# Altium schematic sheet PCB Schematic.SchDoc
size Letter
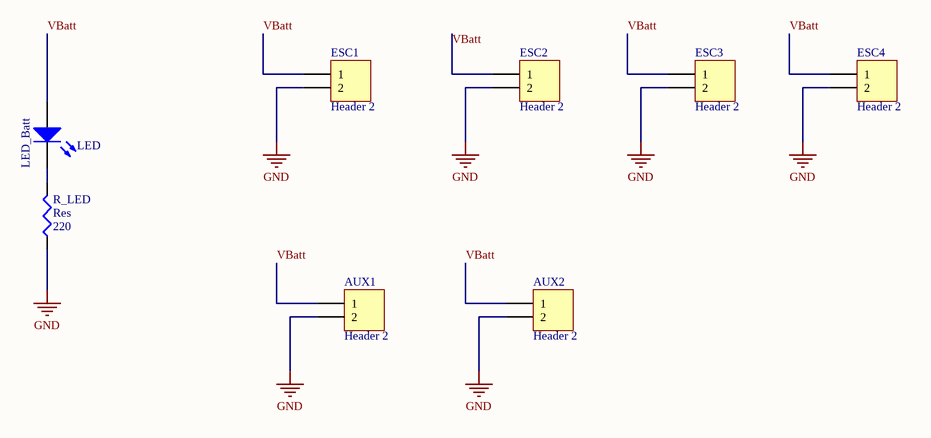
[diagram p0: PCB Schematic.SchDoc]

## Parts
AUX1  Header 2  [HDR1X2]
AUX2  Header 2  [HDR1X2]
ESC1  Header 2  [Banana 3.5mm PowerPad]
ESC2  Header 2  [Banana 3.5mm PowerPad]
ESC3  Header 2  [Banana 3.5mm PowerPad]
ESC4  Header 2  [Banana 3.5mm PowerPad]
LED_Batt  LED  [6-0805_L]
R_LED  Res  value 220  [6-0805_L]

## Nets
GND: AUX1.2 AUX2.2 ESC1.2 ESC2.2 ESC3.2 ESC4.2 R_LED.1
VBatt: AUX1.1 AUX2.1 ESC1.1 ESC2.1 ESC3.1 ESC4.1 LED_Batt.1(A)
NetLED_Batt_2: LED_Batt.2(K) R_LED.2

## Library data of the parts
AUX1 AUX2 ESC1-ESC4 = Header 2: Header, 2-Pin; LatestRevisionDate: 17-Jul-2002; LatestRevisionNote: Re-released for DXP Platform.; Publisher: Altium Limited
LED_Batt = LED2: Typical RED, GREEN, YELLOW, AMBER GaAs LED; Published: 8-Jun-2000; LatestRevisionDate: 17-Jul-2002; LatestRevisionNote: Re-released for DXP Platform.; PackageVersion: Feb-2002; PackageReference: 3.2X1.6X1.1; Publisher: Altium Limited; PackageDescription: SM LED; 2 Flat Leads
R_LED = Res3: Resistor; Published: 8-Jun-2000; LatestRevisionDate: 29-May-2009; LatestRevisionNote: IPC-7351 Footprint Added.; PackageReference: J1-0603; Publisher: Altium Limited; PackageDescription: Chip Resistor